# Altium project PLWD_Schematics.PrjPcb (part 2 of 3)

## Sheet GPS_CAM-M8Q.SchDoc
size A4; SheetNumber: 4; SheetTotal: 10
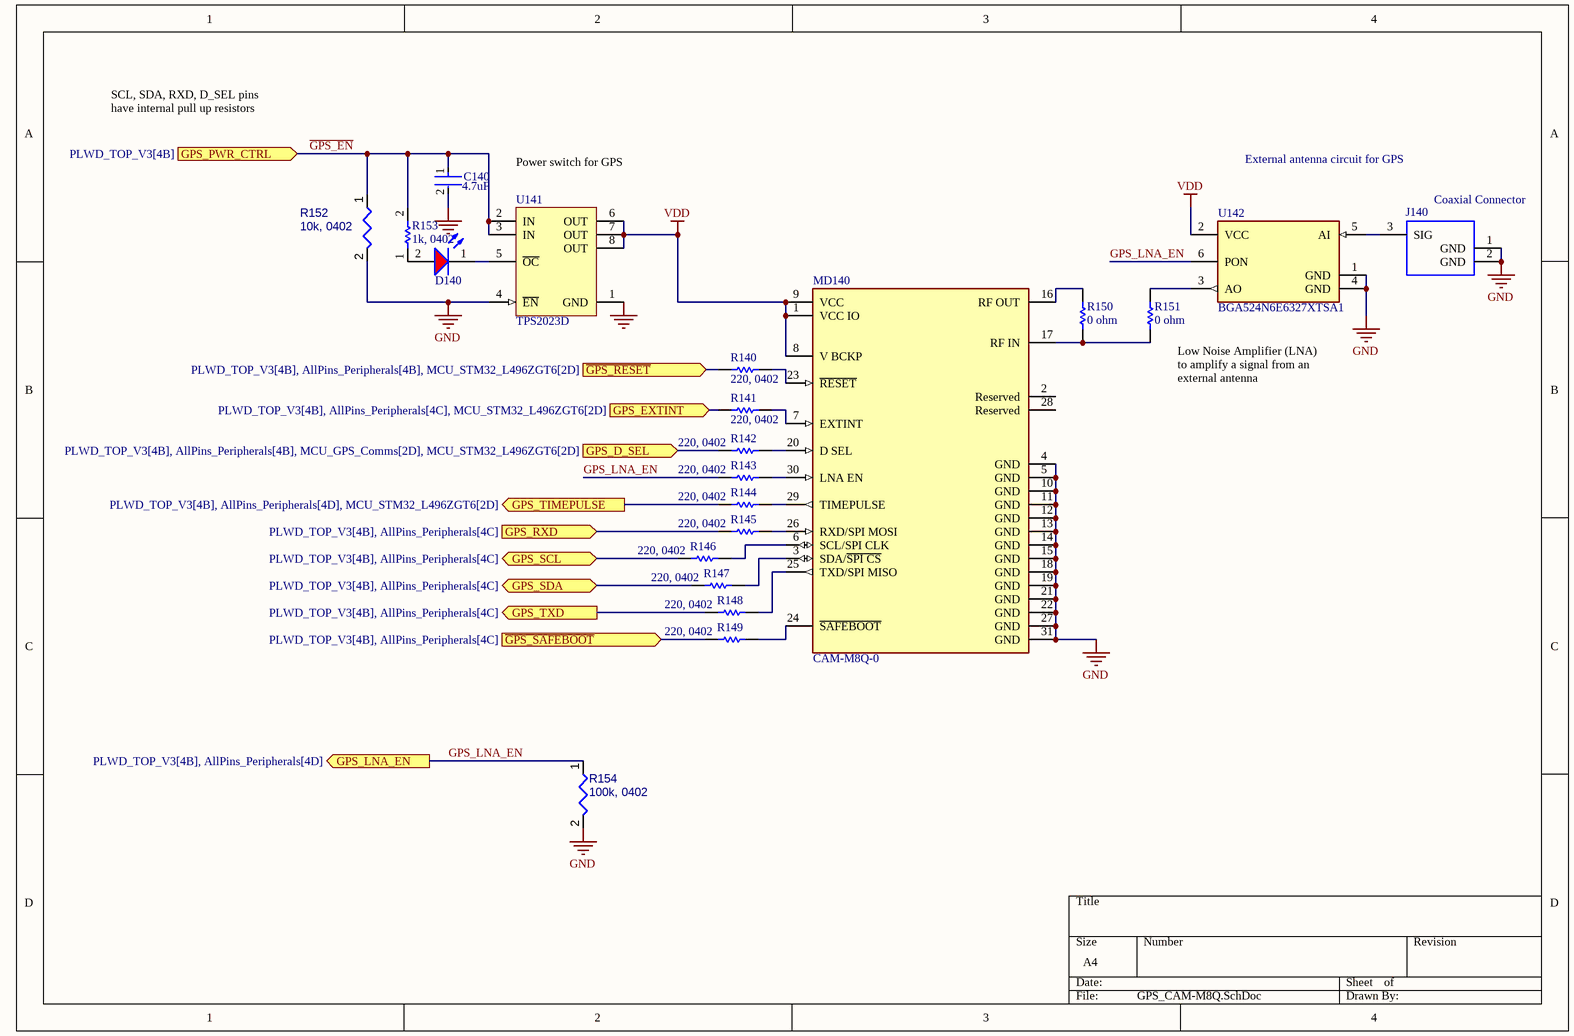
[diagram p3: GPS_CAM-M8Q.SchDoc]

### Parts
C140  Capacitance: 4.7uF  [FP-CL282-IPC_C]  (hidden comment: CL05A475MP5NRNC)
D140  150120SS75000  [WL-SMCW_1206_150120xx75000]  (value not drawn)
J140  Coaxial Connector  [HRS-U.FL-R-SMT_V]
MD140  CAM-M8Q-0  [FP-CAM-M8Q-0-MFG]
R140  220, 0402  [RESC1005X40X25LL10T10]
R141  220, 0402  [RESC1005X40X25LL10T10]
R142  220, 0402  [RESC1005X40X25LL10T10]
R143  220, 0402  [RESC1005X40X25LL10T10]
R144  220, 0402  [RESC1005X40X25LL10T10]
R145  220, 0402  [RESC1005X40X25LL10T10]
R146  220, 0402  [RESC1005X40X25LL10T10]
R147  220, 0402  [RESC1005X40X25LL10T10]
R148  220, 0402  [RESC1005X40X25LL10T10]
R149  220, 0402  [RESC1005X40X25LL10T10]
R150  0 ohm  [RESC1005X40X25LL05T10]
R151  0 ohm  [RESC1005X40X25LL05T10]
R152  10k, 0402  [RESC1005X40X25ML05T05]
R153  1k, 0402  [RESC1005X40X25ML05T05]
R154  100k, 0402  [RESC1005X40X25ML05T05]
U141  TPS2023D  [D0008A_M]
U142  BGA524N6E6327XTSA1  [FP-PG-TSNP-6-MFG]

### Ports
GPS_D_SEL (in, see PLWD_TOP_V3[4B], AllPins_Peripherals[4B], MCU_GPS_Comms[2D], MCU_STM32_L496ZGT6[2D]), GPS_EXTINT (in, see PLWD_TOP_V3[4B], AllPins_Peripherals[4C], MCU_STM32_L496ZGT6[2D]), GPS_LNA_EN (out, see PLWD_TOP_V3[4B], AllPins_Peripherals[4D]), GPS_PWR_CTRL (in, see PLWD_TOP_V3[4B]), GPS_RXD (in, see PLWD_TOP_V3[4B], AllPins_Peripherals[4C]), GPS_SCL (bidir, see PLWD_TOP_V3[4B], AllPins_Peripherals[4C]), GPS_SDA (bidir, see PLWD_TOP_V3[4B], AllPins_Peripherals[4C]), GPS_TIMEPULSE (out, see PLWD_TOP_V3[4B], AllPins_Peripherals[4D], MCU_STM32_L496ZGT6[2D]), GPS_TXD (out, see PLWD_TOP_V3[4B], AllPins_Peripherals[4C]), ~{GPS_RESET} (in, see PLWD_TOP_V3[4B], AllPins_Peripherals[4B], MCU_STM32_L496ZGT6[2D]), ~{GPS_SAFEBOOT} (in, see PLWD_TOP_V3[4B], AllPins_Peripherals[4C])

### Nets
GND: C140.2 J140.1(GND) J140.2(GND) MD140.4(GND) MD140.5(GND) MD140.10(GND) MD140.11(GND) MD140.12(GND) MD140.13(GND) MD140.14(GND) MD140.15(GND) MD140.18(GND) MD140.19(GND) MD140.21(GND) MD140.22(GND) MD140.27(GND) MD140.31(GND) R152.2 R154.2 U141.1(GND) U141.4(~{EN}) U142.1(GND) U142.4(GND)
VDD: MD140.1(VCC_IO) MD140.8(V_BCKP) MD140.9(VCC) U141.6(OUT) U141.7(OUT) U141.8(OUT) U142.2(VCC)  [project net VDD_MCU]
~{GPS_EN}: C140.1 R152.1 R153.2 U141.2(IN) U141.3(IN) ; port GPS_PWR_CTRL
~{GPS_RESET}: R140.2 ; port ~{GPS_RESET}
~{GPS_SBT}: R149.2 ; port ~{GPS_SAFEBOOT}
GPS_D_SEL: R142.2 ; port GPS_D_SEL
GPS_EXTINT: R141.2 ; port GPS_EXTINT
GPS_LNA_EN: R143.2 R154.1 U142.6(PON) ; port GPS_LNA_EN
GPS_RXD/SPI_MOSI: R145.2 ; port GPS_RXD
GPS_SCL/SPI_CLK: R146.2 ; port GPS_SCL
GPS_SDA/SPI_SSEL: R147.2 ; port GPS_SDA
GPS_TIMEPULSE: R144.2 ; port GPS_TIMEPULSE
GPS_TXD/SPI_MISO: R148.2 ; port GPS_TXD
NetD140_1: D140.1(K) U141.5(~{OC})
NetD140_2: D140.2(A) R153.1
NetJ140_3: J140.3(SIG) U142.5(AI)
NetMD140_3: MD140.3(SDA/~{SPI_CS}) R147.1
NetMD140_6: MD140.6(SCL/SPI_CLK) R146.1
NetMD140_7: MD140.7(EXTINT) R141.1
NetMD140_16: MD140.16(RF_OUT) R150.2
NetMD140_17: MD140.17(RF_IN) R150.1 R151.1
NetMD140_20: MD140.20(D_SEL) R142.1
NetMD140_23: MD140.23(~{RESET}) R140.1
NetMD140_24: MD140.24(~{SAFEBOOT}) R149.1
NetMD140_25: MD140.25(TXD/SPI_MISO) R148.1
NetMD140_26: MD140.26(RXD/SPI_MOSI) R145.1
NetMD140_29: MD140.29(TIMEPULSE) R144.1
NetMD140_30: MD140.30(LNA_EN) R143.1
NetR151_2: R151.2 U142.3(AO)

Not connected (* = marked no-connect by the designer): MD140 2(Reserved) 28(Reserved)

### Notes on the sheet
- SCL, SDA, RXD, D_SEL pins have internal pull up resistors
- (near U141) Power switch for GPS
- External antenna circuit for GPS
- (near R151) Low Noise Amplifier (LNA) to amplify a signal from an external antenna

### Library data of the parts
C140 = CMP-13271-000548-1: as C112 on sheet MCU_STM32_L496ZGT6; Max Operating Temperature: 85°C; Lead Free: Lead Free; Tolerance: 20%; Voltage Rating: 10V; Dielectric: X5R; Width: 0.02inch; Length: 0.039inch; Case/Package: 0402; Min Operating Temperature: -55°C; Packaging: Tape and Reel; Thickness: 0.022inch; Case Code (Imperial): 0402; Package Quantity: 10000; Case Code (Metric): 1005; Mount: Surface Mount
D140 = CMP-1426-00017-2: NexarPartId: 29717789; Luminous Intensity: 60mcd; Viewing Angle: 140°; Test Current: 20mA; Lens Style: Clear, Rectangular; Wavelength: 630nm; Max Reverse Voltage (DC): 5V; Color: Red; Forward Current: 100mA; Peak Wavelength: 645nm; Forward Voltage: 1.9V; Case Code (Imperial): 1206; Mount: Surface Mount; Height: 680µm; RoHS: Compliant; REACH SVHC: Unknown; Case Code (Metric): 3216; Width: 1.6mm; Dominant Wavelength: 630nm; Packaging: Tape and Reel; Min Operating Temperature: -40°C; Max Operating Temperature: 85°C; Case/Package: 1206; Length: 3.2mm
J140 = CMP-002-00035-2: Ultra Small Surface Mount Coaxial Connector, 50 Ohm, -40 to 90 degC, 3-Pin SMD, RoHS, Tape and Reel; Manufacturer: Hirose Electric; Impedance: 50Ohm; Connector Type: RF&Coax; Max Operating Temperature: 90°C; Contact Material: Brass; Packaging: TapeandReel; Mounting Technology: SM; Package Quantity: 2500; Min Operating Temperature: -40°C; Contact Plating: Gold; RoHS Compliant: True; Datasheet Version: Aug-16; Package Description: 3-Pin Surface Mount Device, Body 2.6 x 2.6 mm; Datasheet URL: https://www.hirose.com/product/en/download_file/key_name/U.FL/category/Catalog/doc_file_id/31697/?file_category_id=4&item_id=15&is_series=1; Package Reference: U.FL-R-SMT; Fastening Type: Snap; Resistance: 50Ohm; Manufacturer URL: https://www.hirose.com; Case/Package: U.FL-R-SMT
MD140 = CMP-207130-000001-1: RF RCVR GNSS/GPS 1.575GHZ MODULE; Manufacturer: u-blox; Data Rate: 400kbits/s; Max Frequency: 1602MHz; Min Supply Voltage: 1.4V; Nominal Supply Current: 10.4-30mA; Sensitivity: -138dBm; Interface: I2C,SPI,UART; Max Supply Voltage: 3.6V; Automotive Grade: NA; Octopart: https://octopart.com/cam-m8q-0-u-blox-54356730; Automotive: No; Package: CAM-M8Q-0; Device Class L1: Integrated Circuits (ICs); RoHS: TRUE; Footprint Url: https://www.u-blox.com/sites/default/files/CAM-M8-FW3_HardwareIntegrationManual_%28UBX-15030063%29.pdf; Height: 2.3mm; Device Class L3: RF Receivers; Temperature Range Low: -40°C; Manufacturer Part Number: CAM-M8Q-0; Device Class L2: RF Semiconductors and Devices; Temperature Range High: +85°C; ComponentLink2Description: Datasheet; Digikey Description: RF RCVR GNSS/GPS 1.575GHZ MODULE; ComponentLink2URL: https://www.u-blox.com/sites/default/files/CAM-M8-FW3_DataSheet_%28UBX-15031574%29.pdf; Category: UNK; Temperature: -40°C to +85°C; Lead Free: Yes
R140-R149 = CMP-2002-03891-1: Part Number: RK73H1ETTP2200F; Manufacturer: KOA Speer
R150 R151 = CMP-2002-06455-1: Manufacturer: Panasonic; Part Number: ERJ-S020R00X
R152 = CMP-009-00015-5: as R101 on sheet MCU_STM32_L496ZGT6; Case/Package: 0402; Value: 10k; RoHS Compliant: True; Min Operating Temperature: -55°C; Mounting Technology: SM; Tolerance: 1%; Max Operating Temperature: 155°C; Pins: 2
R153 = CMP-009-00009-5: Chip Resistor, 1 KOhm, +/- 1%, 0.1 W, -55 to 155 degC, 0402 (1005 Metric); Power: 100mW; Voltage Rating: 50V; Min Operating Temperature: -55°C; Max Operating Temperature: 155°C; RoHS Compliant: True; Mounting Technology: SM; Pins: 2; Tolerance: 1%; Case/Package: 0402; Value: 1k
R154 = CMP-009-00022-5: Chip Resistor, 100 KOhm, +/- 1%, 0.1 W, -55 to 155 degC, 0402 (1005 Metric); Power: 100mW; Voltage Rating: 50V; Mounting Technology: SM; Pins: 2; Value: 100k; Min Operating Temperature: -55°C; Tolerance: 1%; RoHS Compliant: True; Case/Package: 0402; Max Operating Temperature: 155°C
U141 = CMP-0337-00189-2: 1.65 A, 2.7 to 5.5 V Single Power Distribution Switch IC Hi-Side MOSFET, Fault Report, 33 mOhms rDS(On), -40 to 85 degC, 8-pin SOIC (D), Green (RoHS & no Sb/Br); Manufacturer: Texas Instruments; Continuous Current(Max)(A): 1.5; Enable: Active Low; Number of Switches: 1; Current Limit(A): 2.2; Vin(Max)(V): 5.5; Vin(Min)(V): 2.7; rDS(on) per FET(Typ)(mOhms): 33; Rating: Catalog; Eco-Plan: Green (RoHS & no Sb/Br); PartNumber: TPS2023D; PackageVersion: revM, Jun-2011; ComponentLink1URL: http://www.ti.com/general/docs/lit/getliterature.tsp?genericPartNumber=TPS2023&fileType=pdf; Code_JEDEC: MS-012AA; DatasheetVersion: SLVS175C; ComponentLink1Description: Datasheet; Mounting Technology: Surface Mount; PackageDescription: 8-Pin Plastic Small Outline Integrated Circuit, 4.9 x 3.9 mm, Pitch 1.27 mm Pitch; PackageReference: D0008A
U142 = CMP-32860-000011-1: IC AMP GPS 1.55-1.615GHZ TSNP6-2; P1dB: -16dBm; Gain: 19.6dB; Operating Supply Current: 2.5mA; Noise Figure: 0.55dB; Number of Channels: 1; Mount: Surface Mount; Frequency: 1.615GHz; Number of Pins: 6; Lead Free: Lead Free; Packaging: Cut Tape; Package Quantity: 15000; Series: -; Halogen Free: Halogen Free; RoHS Compliant: Yes; Test Frequency: 1.615GHz

## Sheet BLE_ESP32-WROOM-32.SchDoc
size A4; SheetNumber: 5; SheetTotal: 9
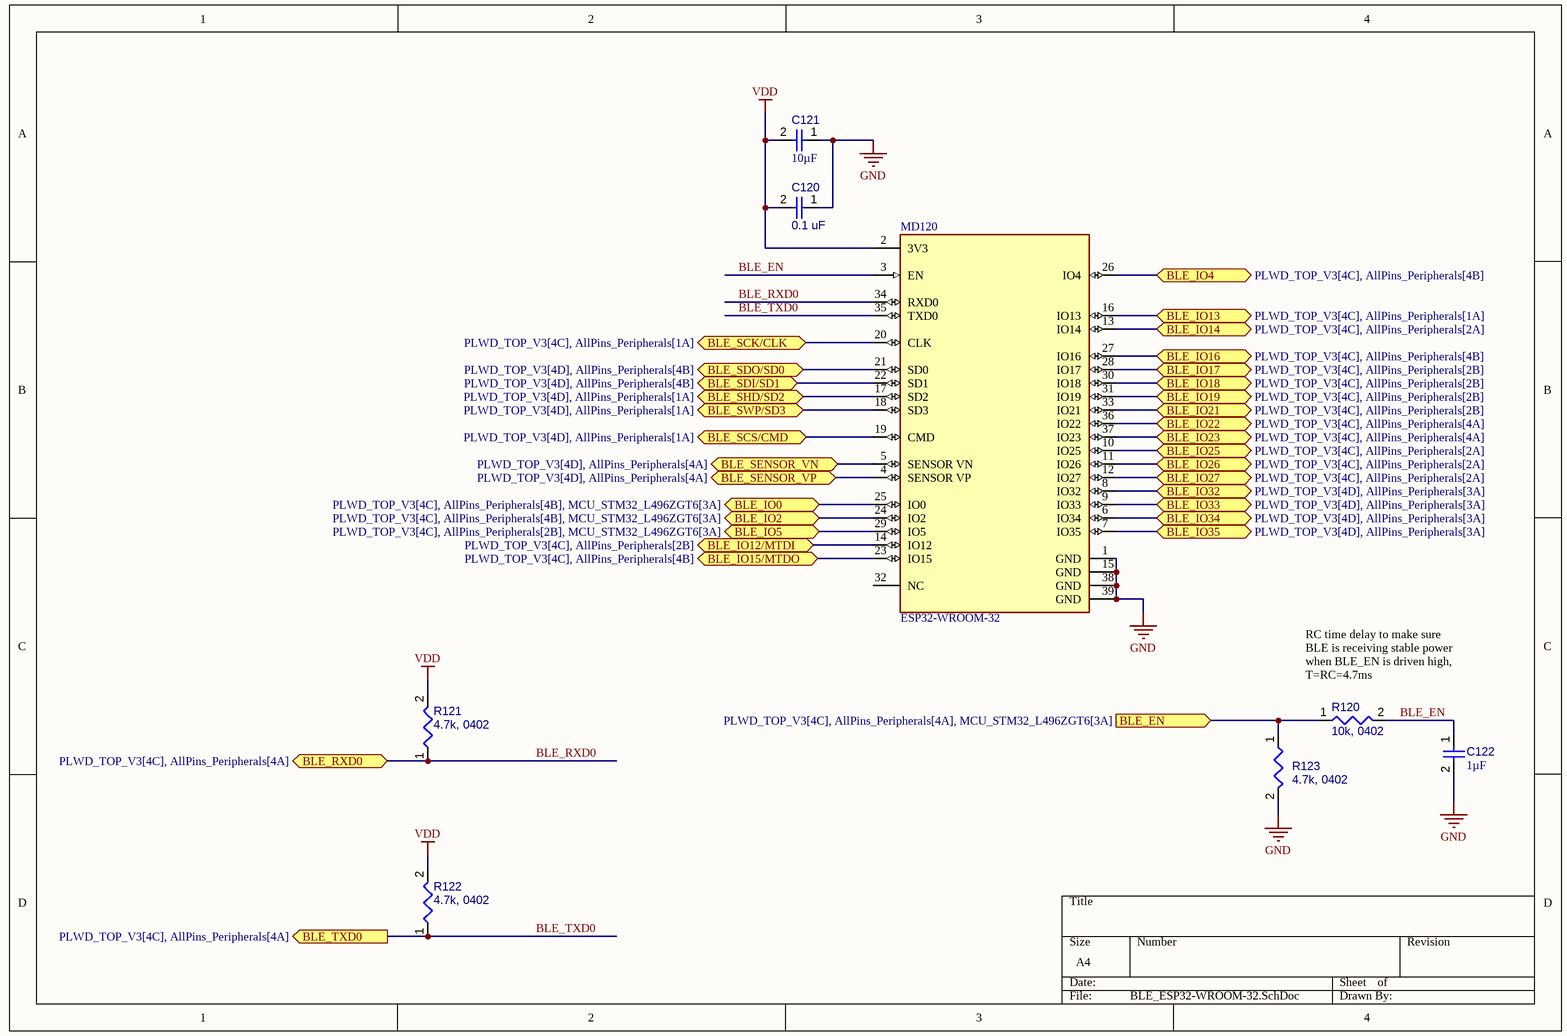
[diagram p4: BLE_ESP32-WROOM-32.SchDoc]

### Parts
C120  0.1 uF  [CAPC1005X56X25LL10T15]
C121  value 10µF  [CAPC0603(1608)100_L]  (hidden comment: Capacitor 10µF +/-20% 10V 0603)
C122  value 1µF  [CAPC0402(1005)60_L]  (hidden comment: Capacitor 1µF +/-20% 10V 0402)
MD120  ESP32-WROOM-32  [FP-ESP32-WROOM-32-MFG]
R120  10k, 0402  [RESC1005X40X25ML05T05]
R121  4.7k, 0402  [RESC0402(1005)_L]
R122  4.7k, 0402  [RESC0402(1005)_L]
R123  4.7k, 0402  [RESC0402(1005)_L]

### Ports
BLE_EN (in, see PLWD_TOP_V3[4C], AllPins_Peripherals[4A], MCU_STM32_L496ZGT6[3A]), BLE_IO0 (bidir, see PLWD_TOP_V3[4C], AllPins_Peripherals[4B], MCU_STM32_L496ZGT6[3A]), BLE_IO2 (bidir, see PLWD_TOP_V3[4C], AllPins_Peripherals[4B], MCU_STM32_L496ZGT6[3A]), BLE_IO4 (bidir, see PLWD_TOP_V3[4C], AllPins_Peripherals[4B]), BLE_IO5 (bidir, see PLWD_TOP_V3[4C], AllPins_Peripherals[2B], MCU_STM32_L496ZGT6[3A]), BLE_IO12/MTDI (bidir, see PLWD_TOP_V3[4C], AllPins_Peripherals[2B]), BLE_IO13 (bidir, see PLWD_TOP_V3[4C], AllPins_Peripherals[1A]), BLE_IO14 (bidir, see PLWD_TOP_V3[4C], AllPins_Peripherals[2A]), BLE_IO15/MTDO (bidir, see PLWD_TOP_V3[4C], AllPins_Peripherals[4B]), BLE_IO16 (bidir, see PLWD_TOP_V3[4C], AllPins_Peripherals[4B]), BLE_IO17 (bidir, see PLWD_TOP_V3[4C], AllPins_Peripherals[2B]), BLE_IO18 (bidir, see PLWD_TOP_V3[4C], AllPins_Peripherals[2B]), BLE_IO19 (bidir, see PLWD_TOP_V3[4C], AllPins_Peripherals[2B]), BLE_IO21 (bidir, see PLWD_TOP_V3[4C], AllPins_Peripherals[2B]), BLE_IO22 (bidir, see PLWD_TOP_V3[4C], AllPins_Peripherals[4A]), BLE_IO23 (bidir, see PLWD_TOP_V3[4C], AllPins_Peripherals[4A]), BLE_IO25 (bidir, see PLWD_TOP_V3[4C], AllPins_Peripherals[2A]), BLE_IO26 (bidir, see PLWD_TOP_V3[4C], AllPins_Peripherals[2A]), BLE_IO27 (bidir, see PLWD_TOP_V3[4C], AllPins_Peripherals[2A]), BLE_IO32 (bidir, see PLWD_TOP_V3[4D], AllPins_Peripherals[3A]), BLE_IO33 (bidir, see PLWD_TOP_V3[4D], AllPins_Peripherals[3A]), BLE_IO34 (bidir, see PLWD_TOP_V3[4D], AllPins_Peripherals[3A]), BLE_IO35 (bidir, see PLWD_TOP_V3[4D], AllPins_Peripherals[3A]), BLE_RXD0 (bidir, see PLWD_TOP_V3[4C], AllPins_Peripherals[4A]), BLE_SCK/CLK (bidir, see PLWD_TOP_V3[4C], AllPins_Peripherals[1A]), BLE_SCS/CMD (bidir, see PLWD_TOP_V3[4D], AllPins_Peripherals[1A]), BLE_SDI/SD1 (bidir, see PLWD_TOP_V3[4D], AllPins_Peripherals[4B]), BLE_SDO/SD0 (bidir, see PLWD_TOP_V3[4D], AllPins_Peripherals[4B]), BLE_SENSOR_VN (bidir, see PLWD_TOP_V3[4D], AllPins_Peripherals[4A]), BLE_SENSOR_VP (bidir, see PLWD_TOP_V3[4D], AllPins_Peripherals[4A]), BLE_SHD/SD2 (bidir, see PLWD_TOP_V3[4D], AllPins_Peripherals[1A]), BLE_SWP/SD3 (bidir, see PLWD_TOP_V3[4D], AllPins_Peripherals[1A]), BLE_TXD0 (out, see PLWD_TOP_V3[4C], AllPins_Peripherals[4A])

### Nets
GND: C120.1 C121.1 C122.2 MD120.1(GND) MD120.15(GND) MD120.38(GND) MD120.39(GND) R123.2
VDD: C120.2 C121.2 MD120.2(3V3) R121.2 R122.2  [project net VDD_MCU]
BLE_EN: R120.1 R123.1 ; port BLE_EN
BLE_EN: C122.1 MD120.3(EN) R120.2  [a separate net that carries the same name]
BLE_IO0: MD120.25(IO0) ; port BLE_IO0
BLE_IO2: MD120.24(IO2) ; port BLE_IO2
BLE_IO4: MD120.26(IO4) ; port BLE_IO4
BLE_IO5: MD120.29(IO5) ; port BLE_IO5
BLE_IO12/MTDI: MD120.14(IO12) ; port BLE_IO12/MTDI
BLE_IO13: MD120.16(IO13) ; port BLE_IO13
BLE_IO14: MD120.13(IO14) ; port BLE_IO14
BLE_IO15_MTDO: MD120.23(IO15) ; port BLE_IO15/MTDO
BLE_IO16: MD120.27(IO16) ; port BLE_IO16
BLE_IO17: MD120.28(IO17) ; port BLE_IO17
BLE_IO18: MD120.30(IO18) ; port BLE_IO18
BLE_IO19: MD120.31(IO19) ; port BLE_IO19
BLE_IO21: MD120.33(IO21) ; port BLE_IO21
BLE_IO22: MD120.36(IO22) ; port BLE_IO22
BLE_IO23: MD120.37(IO23) ; port BLE_IO23
BLE_IO25: MD120.10(IO25) ; port BLE_IO25
BLE_IO26: MD120.11(IO26) ; port BLE_IO26
BLE_IO27: MD120.12(IO27) ; port BLE_IO27
BLE_IO32: MD120.8(IO32) ; port BLE_IO32
BLE_IO33: MD120.9(IO33) ; port BLE_IO33
BLE_IO34: MD120.6(IO34) ; port BLE_IO34
BLE_IO35: MD120.7(IO35) ; port BLE_IO35
BLE_RXD0: MD120.34(RXD0) R121.1 ; port BLE_RXD0
BLE_SCK/CLK: MD120.20(CLK) ; port BLE_SCK/CLK
BLE_SCS/CMD: MD120.19(CMD) ; port BLE_SCS/CMD
BLE_SDI/SD1: MD120.22(SD1) ; port BLE_SDI/SD1
BLE_SDO/SD0: MD120.21(SD0) ; port BLE_SDO/SD0
BLE_SENSOR_VN: MD120.5(SENSOR_VN) ; port BLE_SENSOR_VN
BLE_SENSOR_VP: MD120.4(SENSOR_VP) ; port BLE_SENSOR_VP
BLE_SHD/SD2: MD120.17(SD2) ; port BLE_SHD/SD2
BLE_SWP/SD3: MD120.18(SD3) ; port BLE_SWP/SD3
BLE_TXD0: MD120.35(TXD0) R122.1 ; port BLE_TXD0

Not connected (* = marked no-connect by the designer): MD120 32(NC)

### Notes on the sheet
- (near R120) RC time delay to make sure BLE is receiving stable power when BLE_EN is driven high, T=RC=4.7ms

### Library data of the parts
C120 = CMP-001-00001-6: as C100 on sheet MCU_STM32_L496ZGT6; Min Operating Temperature: -55°C; Pins: 2; Case/Package: 0402; Max Operating Temperature: 125°C; Mounting Technology: SM; RoHS Compliant: True; Tolerance: 5%
C121 = CMP-001-00075-4: Chip Capacitor, 10µF +/-20%, 10V, 0603, Thickness 1 mm; Tolerance: 10%; Voltage Rating: 10V; Max Operating Temperature: 85°C; Pins: 2; Case/Package: 0603; Mounting Technology: SMT; Min Operating Temperature: -55°C
C122 = CMP-001-00063-3: as C114 on sheet MCU_STM32_L496ZGT6; Mounting Technology: SMT; Max Operating Temperature: 85°C; Voltage Rating: 10V; Pins: 2; Case/Package: 0402; Min Operating Temperature: -55°C
MD120 = CMP-194065-000008-1: RX TXRX MOD WIFI SURFACE MOUNT; Frequency: 2.5GHz; Sensitivity: -98dBm; Operating Supply Voltage: 3.6V; Data Rate: 150Mbps; Weight: 0.088185oz; Package Quantity: 550; Min Operating Temperature: -40°C; Mount: Surface Mount; Max Operating Temperature: 85°C; Packaging: Cut Tape; Case/Package: SMD/SMT
R120 = CMP-009-00015-5: as R101 on sheet MCU_STM32_L496ZGT6; Case/Package: 0402; Value: 10k; RoHS Compliant: True; Min Operating Temperature: -55°C; Mounting Technology: SM; Tolerance: 1%; Max Operating Temperature: 155°C; Pins: 2
R121-R123 = CMP-009-00158-3: as R100 on sheet MCU_STM32_L496ZGT6; Max Operating Temperature: 155°C; Pins: 2; Value: 4.7k; Min Operating Temperature: -55°C; Case/Package: 0402

## Sheet PowerSupply.SchDoc
size A4; SheetNumber: 6; SheetTotal: 10
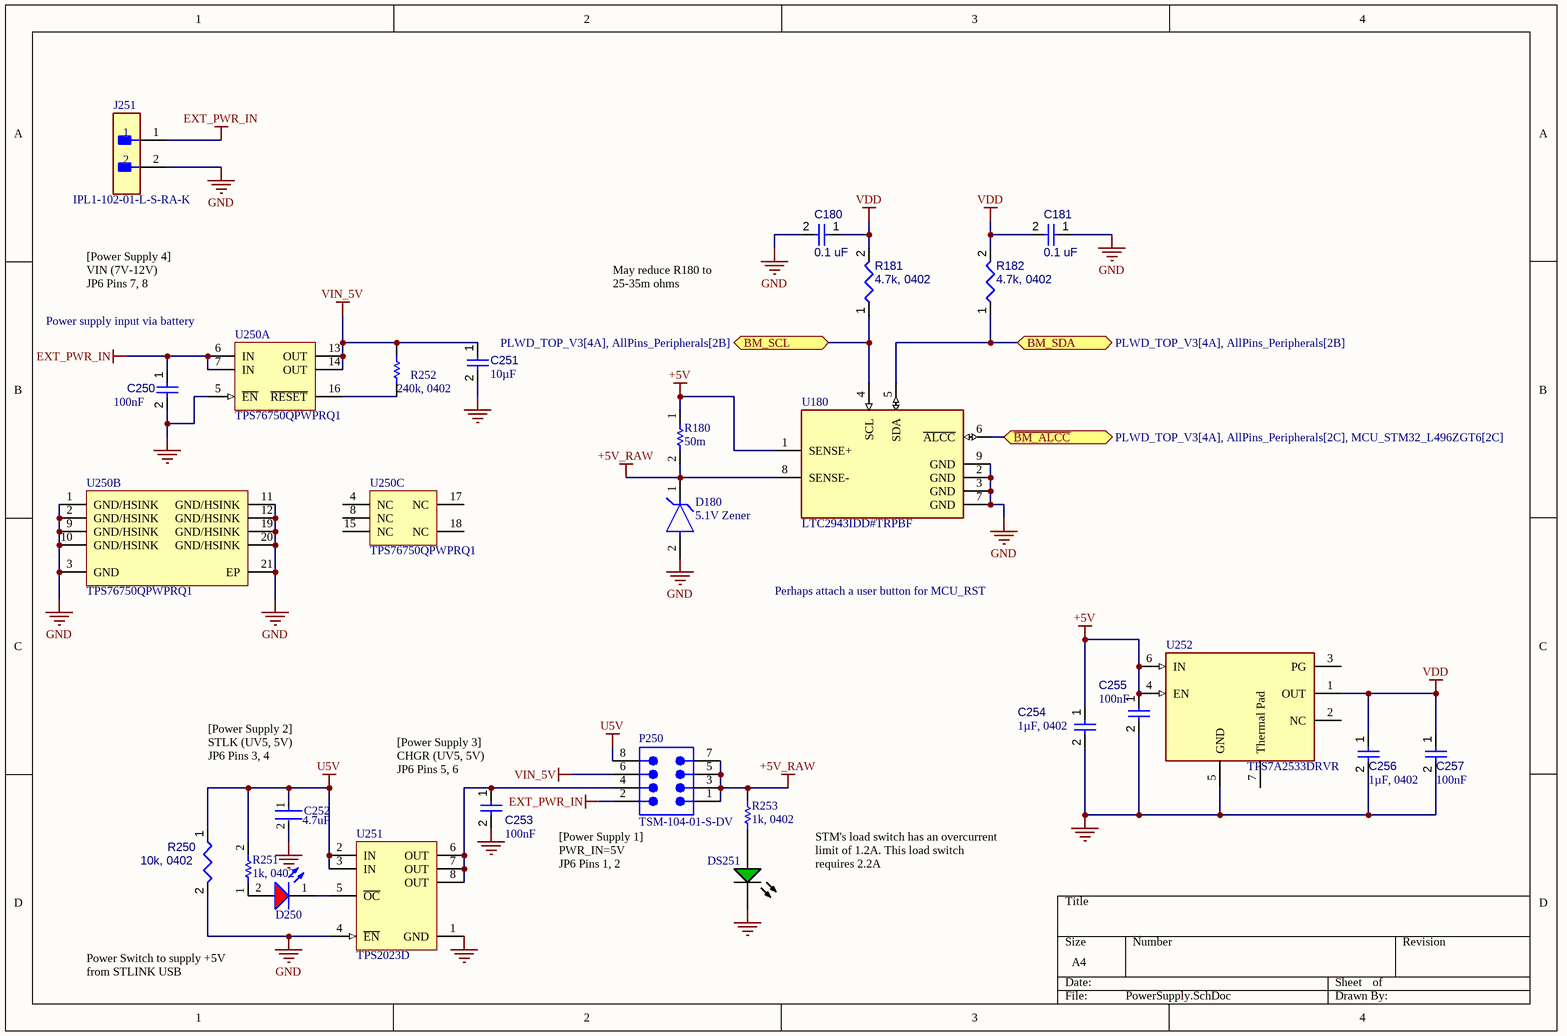
[diagram p5: PowerSupply.SchDoc]

### Parts
C180  0.1 uF  [CAPC1005X56X25LL10T15]
C181  0.1 uF  [CAPC1005X56X25LL10T15]
C250  value 100nF  [CAPC1005X56X25LL10T15]  (hidden comment: Capacitor 0.1 uF +/- 5% 16 V 0402)
C251  value 10µF  [CAPC0603(1608)100_L]  (hidden comment: Capacitor 10µF +/-20% 10V 0603)
C252  Capacitance: 4.7uF  [FP-CL282-IPC_C]  (hidden comment: CL05A475MP5NRNC)
C253  value 100nF  [CAPC1005X56X25LL10T15]  (hidden comment: Capacitor 0.1 uF +/- 5% 16 V 0402)
C254  value 1µF, 0402  [CAPC0402(1005)60_L]  (hidden comment: Capacitor 1µF +/-20% 10V 0402)
C255  value 100nF  [CAPC1005X56X25LL10T15]  (hidden comment: Capacitor 0.1 uF +/- 5% 16 V 0402)
C256  value 1µF, 0402  [CAPC0402(1005)60_L]  (hidden comment: Capacitor 1µF +/-20% 10V 0402)
C257  value 100nF  [CAPC1005X56X25LL10T15]  (hidden comment: Capacitor 0.1 uF +/- 5% 16 V 0402)
D180  5.1V Zener  [FP-SOD123-MFG]
D250  150120SS75000  [WL-SMCW_1206_150120xx75000]  (value not drawn)
DS251  LTST-C190GKT  [LTST-C190GKT_V]  (value not drawn)
J251  IPL1-102-01-L-S-RA-K  [FP-IPL1-102-01-L-S-RA-K-0]
P250  TSM-104-01-S-DV  [SMTC-TSM-104-01-X-DV]
R180  50m  [RESC1608X55X30NL15T15]
R181  4.7k, 0402  [RESC0402(1005)_L]
R182  4.7k, 0402  [RESC0402(1005)_L]
R250  10k, 0402  [RESC1005X40X25ML05T05]
R251  1k, 0402  [RESC1005X40X25ML05T05]
R252  240k, 0402  [RESC1005X40X25NL05T05]
R253  1k, 0402  [RESC1005X40X25ML05T05]
U180  LTC2943IDD#TRPBF  [FP-DD-8-05-08-1698-IPC_B]
U250  TPS76750QPWPRQ1  [PWP0020L_N]  (parts A,B,C of 3)
U251  TPS2023D  [D0008A_M]
U252  TPS7A2533DRVR  [FP-DRV0006A-IPC_C]

### Ports
BM_SCL (bidir, see PLWD_TOP_V3[4A], AllPins_Peripherals[2B]), BM_SDA (bidir, see PLWD_TOP_V3[4A], AllPins_Peripherals[2B]), ~{BM_ALCC} (bidir, see PLWD_TOP_V3[4A], AllPins_Peripherals[2C], MCU_STM32_L496ZGT6[2C])

### Nets
+5V: C254.1 C255.1 R180.1 U180.1(SENSE+) U252.4(EN) U252.6(IN)
+5V_RAW: D180.1(C) P250.1 P250.3 P250.5 P250.7 R180.2 R253.2 U180.8(SENSE-)
EXT_PWR_IN: C250.1 J251.1 P250.2 U250.6(IN) U250.7(IN)
GND: C180.2 C181.1 C250.2 C251.2 C252.2 C253.2 C254.2 C255.2 C256.2 C257.2 D180.2(A) DS251.2(K) J251.2 R250.2 U180.2(GND) U180.3(GND) U180.7(GND) U180.9(GND) U250.1(GND/HSINK) U250.2(GND/HSINK) U250.3(GND) U250.5(~{EN}) U250.9(GND/HSINK) U250.10(GND/HSINK) U250.11(GND/HSINK) U250.12(GND/HSINK) U250.19(GND/HSINK) U250.20(GND/HSINK) U250.21(EP) U251.1(GND) U251.4(~{EN}) U252.5(GND)
U5V: C252.1 P250.8 R250.1 R251.2 U251.2(IN) U251.3(IN)
VDD: C180.1 C181.2 C256.1 C257.1 R181.2 R182.2 U252.1(OUT)  [project net VDD_MCU]
VIN_5V: C251.1 P250.6 R252.2 U250.13(OUT) U250.14(OUT)
~{BM_ALCC}: U180.6(~{ALCC}) ; port ~{BM_ALCC}
BM_SCL: R181.1 U180.4(SCL) ; port BM_SCL
BM_SDA: R182.1 U180.5(SDA) ; port BM_SDA
NetC253_1: C253.1 P250.4 U251.6(OUT) U251.7(OUT) U251.8(OUT)
NetD250_1: D250.1(K) U251.5(~{OC})
NetD250_2: D250.2(A) R251.1
NetDS251_1: DS251.1(A) R253.1
NetR252_1: R252.1 U250.16(~{RESET})

Not connected (* = marked no-connect by the designer): U250 4(NC) 8(NC) 15(NC) 17(NC) 18(NC); U252 2(NC) 3(PG) 7(Thermal_Pad)

### Notes on the sheet
- [Power Supply 4]
  VIN (7V-12V)
  JP6 Pins 7, 8
- May reduce R180 to 25-35m ohms
- (near U250) Power supply input via battery
- Perhaps attach a user button for MCU_RST
- (near C252) [Power Supply 2]
  STLK (UV5, 5V)
  JP6 Pins 3, 4
- (near C253) [Power Supply 3]
  CHGR (UV5, 5V)
  JP6 Pins 5, 6
- (near P250) [Power Supply 1]
  PWR_IN=5V
  JP6 Pins 1, 2
- STM's load switch has an overcurrent limit of 1.2A. This load switch requires 2.2A
- Power Switch to supply +5V from STLINK USB

### Library data of the parts
C180 C181 = CMP-001-00001-6: Chip Capacitor, 0.1 uF, +/- 5%, 16 V, 0402 (1005 Metric); Value: 100nF; Capacitor Type: Ceramic; Voltage Rating: 16V; Min Operating Temperature: -55°C; Pins: 2; Case/Package: 0402; Max Operating Temperature: 125°C; Mounting Technology: SM; RoHS Compliant: True; Tolerance: 5%
C250 C253 C255 C257 = CMP-001-00001-6: Chip Capacitor, 0.1 uF, +/- 5%, 16 V, 0402 (1005 Metric); Capacitor Type: Ceramic; Voltage Rating: 16V; Max Operating Temperature: 125°C; Min Operating Temperature: -55°C; Case/Package: 0402; Mounting Technology: SM; Pins: 2; Tolerance: 5%; RoHS Compliant: True
C251 = CMP-001-00075-4: Chip Capacitor, 10µF +/-20%, 10V, 0603, Thickness 1 mm; Tolerance: 10%; Voltage Rating: 10V; Max Operating Temperature: 85°C; Pins: 2; Case/Package: 0603; Mounting Technology: SMT; Min Operating Temperature: -55°C
C252 = CMP-13271-000548-1: Cap Ceramic 4.7uF 10V X5R ±20% SMD 0402 +85°C Paper T/R; Max Operating Temperature: 85°C; Lead Free: Lead Free; Tolerance: 20%; Voltage Rating: 10V; Dielectric: X5R; Width: 0.02inch; Length: 0.039inch; Case/Package: 0402; Min Operating Temperature: -55°C; Packaging: Tape and Reel; Thickness: 0.022inch; Case Code (Imperial): 0402; Package Quantity: 10000; Case Code (Metric): 1005; Mount: Surface Mount
C254 C256 = CMP-001-00063-3: Chip Capacitor, 1µF +/-20%, 10V, 0402, Thickness 0.6 mm; Tolerance: 10%; Mounting Technology: SMT; Max Operating Temperature: 85°C; Voltage Rating: 10V; Pins: 2; Case/Package: 0402; Min Operating Temperature: -55°C
D180 = CMP-2000-05976-2: DIODE ZENER 5.1V 500MW SOD123; Manufacturer Part Number: BZT52C5V1-7-F; Manufacturer: Diodes Incorporated; Standoff Height: 0mm; Max Reverse Leakage Current: 2uA; Forward Current: 10mA; Power Dissipation: 370mW; Max Zener Voltage: 5.4V; Zener Impedance: 60Ω; Automotive Grade: NA; Max Junction Temp: +150°C; Device Class L3: Zener Diodes; ComponentLink2Description: Datasheet; Mouser Description: Zener Diodes 5.1V 500mW; Octopart: https://octopart.com/bzt52c5v1-7-f-diodes+inc.-326718; Package: SOD123; RoHS: TRUE; Nom Zener Voltage: 5.1V; Device Class L1: Discrete Semiconductors; Lead Free: Yes; Footprint Url: https://www.diodes.com/assets/Package-Files/SOD123.pdf; ComponentLink2URL: https://www.diodes.com/assets/Datasheets/ds18004.pdf; Digikey Description: DIODE ZENER 5.1V 500MW SOD123; Height: 1.45mm; Temperature Range Low: -65°C; Device Class L2: Diodes; Temperature: -65°C to +150°C; Automotive: No; Temperature Range High: +150°C; Category: Diode
D250 = CMP-1426-00017-2: NexarPartId: 29717789; Luminous Intensity: 60mcd; Viewing Angle: 140°; Test Current: 20mA; Lens Style: Clear, Rectangular; Wavelength: 630nm; Max Reverse Voltage (DC): 5V; Color: Red; Forward Current: 100mA; Peak Wavelength: 645nm; Forward Voltage: 1.9V; Case Code (Imperial): 1206; Mount: Surface Mount; Height: 680µm; RoHS: Compliant; REACH SVHC: Unknown; Case Code (Metric): 3216; Width: 1.6mm; Dominant Wavelength: 630nm; Packaging: Tape and Reel; Min Operating Temperature: -40°C; Max Operating Temperature: 85°C; Case/Package: 1206; Length: 3.2mm
DS251 = CMP-007-00022-2: LED Uni-Color Green, 100 mW, 30 mA, -55 to 85 degC, 2-Pin SMD, RoHS, Tape and Reel; Manufacturer: Lite-On; Power: 100mW; Forward Voltage: 2.1V; Viewing Angle: 130degrees; Forward Current: 20mA; Luminous Intensity: 6mcd; Lens Style: Clear; Manufacturer URL: http://www.us.liteon.com/; RoHS Compliant: True; Colour: Green; Package Description: 2-Pin Surface Mount Device, Body 1.6 x 0.8 mm; Datasheet URL: http://datasheet.octopart.com/LTST-C190GKT-Lite-On-datasheet-158530.pdf; Datasheet Version: Dec-06; Mounting Technology: SM; Case/Package: 0603; Package Reference: C190GKT; Packaging: TapeandReel; Min Operating Temperature: -55°C; Nominal Vf: 2.1V; Package Quantity: 3000; Illumination Colour: Green; Max Operating Temperature: 85°C; Pins: 2
J251 = CMP-02766-000264-1: 2 Position 1 Row .100" (2.54 mm) pitch connector; Number of Terminals/Pins: 2; Number of Ports: 1; Gender: Male; Max Current Rating: 7.4A; Connector Type: Male Pin; Max Voltage Rating (AC): 675V; Pitch: 2.54mm; Min Operating Temperature: -55°C; Number of Contacts: 2; Contact Plating: Gold; REACH SVHC: No SVHC; Packaging: Rail/Tube; Termination: Solder; Length: 6.6mm; Radiation Hardening: No; Contact Material: Bronze; Package Quantity: 1; Contact Mating Length: 0.215inch; Number of Positions: 2; Max Operating Temperature: 125°C; Orientation: Right Angle; Number of Rows: 1; Housing Material: Polymer; Depth: 9.65mm; Fastening Type: Ramp; Mount: Through Hole; Lead Free: Lead Free; Color: Natural
P250 = CMP-1024-00218-1: 0.025" SQ Post Header, Surface Mount, Vertical, -55 to 125 degC, 2.54 mm Pitch, 8-Pin, Male, RoHS; Manufacturer: Samtec; Pitch: 2.54 mm; ComponentLink3URL: http://www.samtec.com/documents/webfiles/cpdf/TSM-1XX-XX-XXX-XX-X-XXX-X-MKT.pdf; ComponentLink1URL: http://www.samtec.com; PackageDescription: Double Row Gullwing ASM; ComponentLink3Description: Package Specification; PackageVersion: DJ, 4/1991; ComponentLink1Description: Manufacturer URL; Orientation: Vertical; Temperature Range: -55 to 125 degC; PartNumber: TSM-104-01-S-DV; ComponentLink2Description: Datasheet; RoHS: True; Mounting Technology: Surface Mount; ComponentLink2URL: http://www.samtec.com/documents/webfiles/pdf/TSM.PDF; PackageReference: TSM-104-01-X-DV; DatasheetVersion: F-214
R180 = CMP-2000-00867-1: Manufacturer: Panasonic; Part Number: ERJ-L03KF50MV
R181 R182 = CMP-009-00158-3: Chip Resistor, 4,7 kOhms, +/-1 %, 63 mW, -55 to 155 degC, 0402; Power: 63mW; Tolerance: 1%; Max Operating Temperature: 155°C; Pins: 2; Value: 4.7k; Min Operating Temperature: -55°C; Case/Package: 0402
R250 = CMP-009-00015-5: Chip Resistor, 10 KOhm, +/- 1%, 0.1 W, -55 to 155 degC, 0402 (1005 Metric); Voltage Rating: 50V; Power: 100mW; Case/Package: 0402; Value: 10k; RoHS Compliant: True; Min Operating Temperature: -55°C; Mounting Technology: SM; Tolerance: 1%; Max Operating Temperature: 155°C; Pins: 2
R251 R253 = CMP-009-00009-5: Chip Resistor, 1 KOhm, +/- 1%, 0.1 W, -55 to 155 degC, 0402 (1005 Metric); Power: 100mW; Voltage Rating: 50V; Min Operating Temperature: -55°C; Max Operating Temperature: 155°C; RoHS Compliant: True; Mounting Technology: SM; Pins: 2; Tolerance: 1%; Case/Package: 0402; Value: 1k
R252 = CMP-2002-00799-3: Chip Resistor, 240 KOhm, +/- 1%, 100 mW, -55 to 155 degC, 0402 (1005 Metric), RoHS, Tape and Reel; Manufacturer: Basic Passives; PartNumber: ERJ-2RKF2403X; Power Rating: 100 mW; Voltage Rating: 50 V; Case\/Package: 0402; DatasheetVersion: 04/2015; RoHSCompliant: true; Resistance: 240 KOhm; Mounting Technology: Surface Mount; Case Code (Imperial): 0402; Height: 0.35 mm; Max Operating Temperature: 155 degC; PackageReference: 0402; ComponentLink1Description: Manufacturer URL; Min Operating Temperature: -55 degC; Package Quantity: 10000; Mount: Surface Mount; Radiation Hardening: No; Case Code (Metric): 1005; Packaging: Tape and Reel; Length: 1 mm; ComponentLink1URL: http://www.panasonic.com/; REACH SVHC: Unknown; Tolerance: 1%; Width: 0.5 mm; PackageDescription: 2-Pin Surface Mount Device, Body 1 x 0.5 mm; Pins: 2; ComponentLink2URL: http://industrial.panasonic.com/cdbs/www-data/pdf/RDA0000/AOA0000C86.pdf; ComponentLink2Description: Datasheet
U180 = CMP-09132-000025-1: IC BATT MONITOR MULTI-CHEM 8DFN; Interface: I2C; Case/Package: DFN; Packaging: Tape and Reel; Number of Pins: 8; Max Operating Temperature: 85°C; RoHS Compliant: Yes; Min Operating Temperature: -40°C
U250 = CMP-0395-01233-2: Single Output Automotive LDO, 1 A, Fixed 5 V Output, 2.7 to 10 V Input, 20-pin HTSSOP (PWP), -40 to 125 degC, Green (RoHS & no Sb/Br); Manufacturer: Texas Instruments; SubFamily: Single Channel LDO; Iout(Max)(A): 1; Vdo(Typ)(mV): 230; Fixed Output Options(V): 5; Vin(Max)(V): 10; Vin(Min)(V): 2.7; Accuracy(%): 2; Iq(Typ)(mA): 0.08; Eco-Plan: Green (RoHS & no Sb/Br); Code_JEDEC: MO-153; PackageVersion: 4073225-4/I; PartNumber: TPS76750QPWPRQ1; DatasheetVersion: SGLS009B; Mounting Technology: Surface Mount; Vout Adj(Max)(V): 5; ComponentLink3URL: http://www.ti.com/litv/pdf/mhts001g; Vout Adj(Min)(V): 5; ComponentLink3Description: Package Specification; ComponentLink1URL: http://www.ti.com/; ComponentLink1Description: Manufacturer URL; PackageReference: PWP0020L; ComponentLink2URL: http://www.ti.com/general/docs/lit/getliterature.tsp?genericPartNumber=TPS76750-Q1&fileType=pdf; ComponentLink2Description: Datasheet; PackageDescription: 20-Pin Plastic Small Outline, Body 4.4 x 6.5 mm, Pitch 0.65 mm
U251 = CMP-0337-00189-2: 1.65 A, 2.7 to 5.5 V Single Power Distribution Switch IC Hi-Side MOSFET, Fault Report, 33 mOhms rDS(On), -40 to 85 degC, 8-pin SOIC (D), Green (RoHS & no Sb/Br); Manufacturer: Texas Instruments; Continuous Current(Max)(A): 1.5; Enable: Active Low; Number of Switches: 1; Current Limit(A): 2.2; Vin(Max)(V): 5.5; Vin(Min)(V): 2.7; rDS(on) per FET(Typ)(mOhms): 33; Rating: Catalog; Eco-Plan: Green (RoHS & no Sb/Br); PartNumber: TPS2023D; PackageVersion: revM, Jun-2011; ComponentLink1URL: http://www.ti.com/general/docs/lit/getliterature.tsp?genericPartNumber=TPS2023&fileType=pdf; Code_JEDEC: MS-012AA; DatasheetVersion: SLVS175C; ComponentLink1Description: Datasheet; Mounting Technology: Surface Mount; PackageDescription: 8-Pin Plastic Small Outline Integrated Circuit, 4.9 x 3.9 mm, Pitch 1.27 mm Pitch; PackageReference: D0008A
U252 = CMP-04917-000317-1: IC REG LINEAR 3.3V 300MA 6WSON

## Sheet AllPins_Peripherals.SchDoc
size A4; SheetNumber: 8; SheetTotal: 10
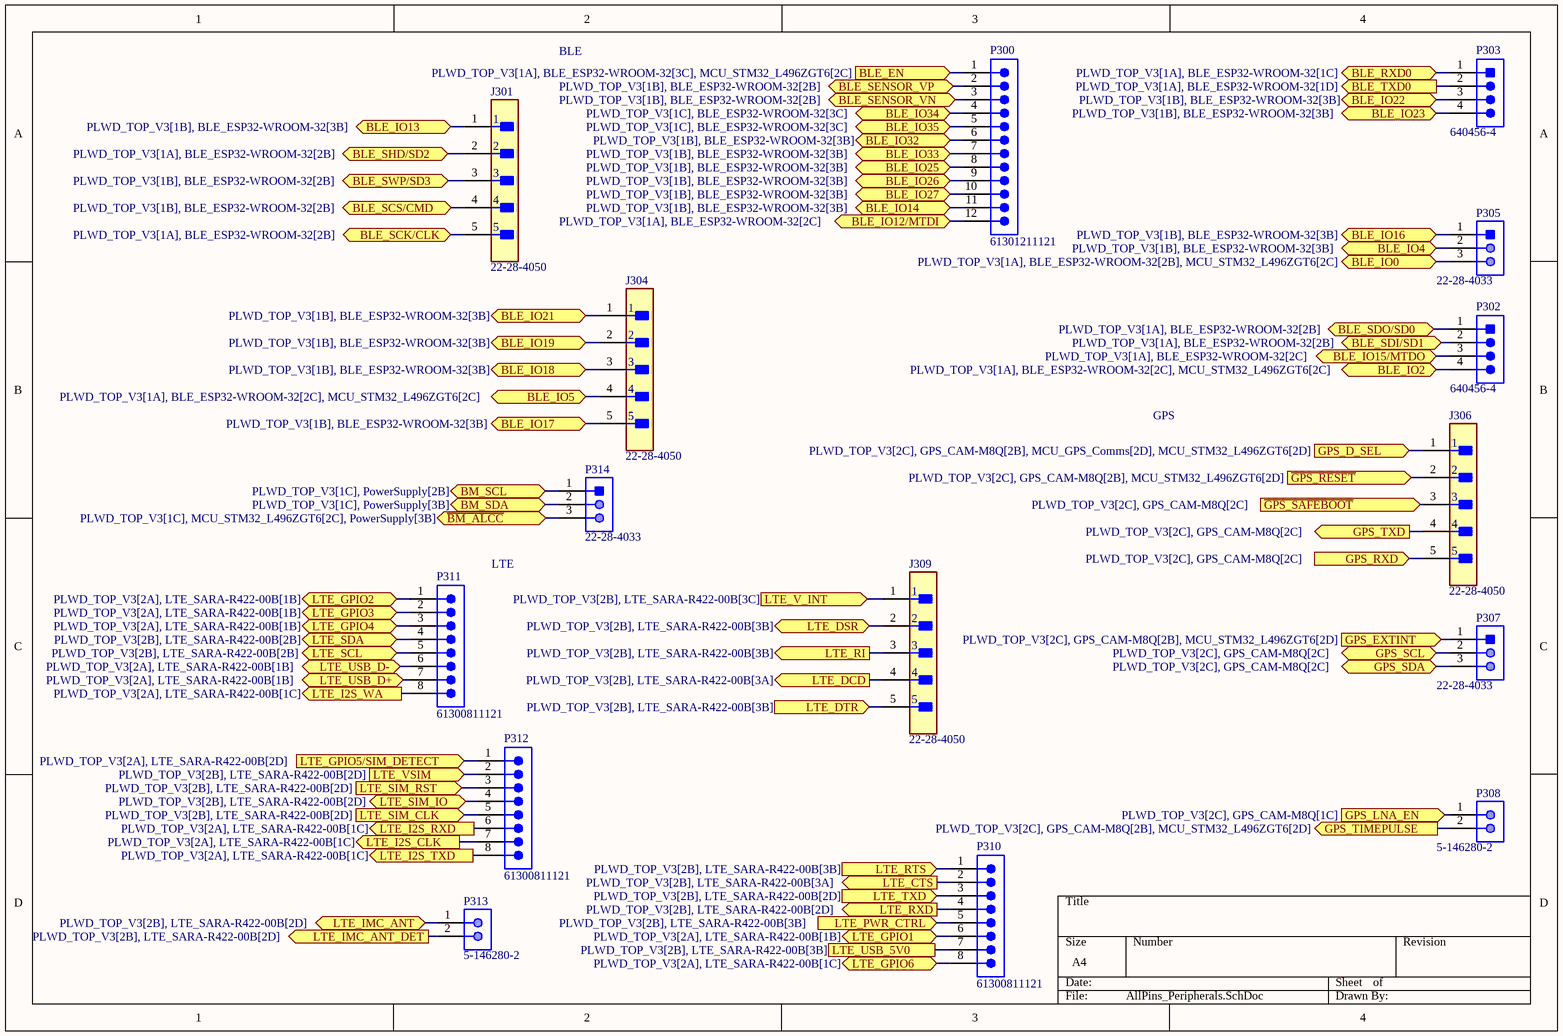
[diagram p6: AllPins_Peripherals.SchDoc]

### Parts
J301  22-28-4050  [FP-22-28-4050-MFG]
J304  22-28-4050  [FP-22-28-4050-MFG]
J306  22-28-4050  [FP-22-28-4050-MFG]
J309  22-28-4050  [FP-22-28-4050-MFG]
P300  61301211121  [61301211121]
P302  640456-4  [TECO-640456-4]
P303  640456-4  [TECO-640456-4]
P305  22-28-4033  [MOLX-22-28-4033_V]
P307  22-28-4033  [MOLX-22-28-4033_V]
P308  5-146280-2  [TECO-5-146280-2_V]
P310  61300811121  [61300811121]
P311  61300811121  [61300811121]
P312  61300811121  [61300811121]
P313  5-146280-2  [TECO-5-146280-2_V]
P314  22-28-4033  [MOLX-22-28-4033_V]

### Ports
BLE_EN (in, see PLWD_TOP_V3[1A], BLE_ESP32-WROOM-32[3C], MCU_STM32_L496ZGT6[2C]), BLE_IO0 (bidir, see PLWD_TOP_V3[1A], BLE_ESP32-WROOM-32[2B], MCU_STM32_L496ZGT6[2C]), BLE_IO2 (bidir, see PLWD_TOP_V3[1A], BLE_ESP32-WROOM-32[2C], MCU_STM32_L496ZGT6[2C]), BLE_IO4 (bidir, see PLWD_TOP_V3[1B], BLE_ESP32-WROOM-32[3B]), BLE_IO5 (bidir, see PLWD_TOP_V3[1A], BLE_ESP32-WROOM-32[2C], MCU_STM32_L496ZGT6[2C]), BLE_IO12/MTDI (bidir, see PLWD_TOP_V3[1A], BLE_ESP32-WROOM-32[2C]), BLE_IO13 (bidir, see PLWD_TOP_V3[1B], BLE_ESP32-WROOM-32[3B]), BLE_IO14 (bidir, see PLWD_TOP_V3[1B], BLE_ESP32-WROOM-32[3B]), BLE_IO15/MTDO (bidir, see PLWD_TOP_V3[1A], BLE_ESP32-WROOM-32[2C]), BLE_IO16 (bidir, see PLWD_TOP_V3[1B], BLE_ESP32-WROOM-32[3B]), BLE_IO17 (bidir, see PLWD_TOP_V3[1B], BLE_ESP32-WROOM-32[3B]), BLE_IO18 (bidir, see PLWD_TOP_V3[1B], BLE_ESP32-WROOM-32[3B]), BLE_IO19 (bidir, see PLWD_TOP_V3[1B], BLE_ESP32-WROOM-32[3B]), BLE_IO21 (bidir, see PLWD_TOP_V3[1B], BLE_ESP32-WROOM-32[3B]), BLE_IO22 (bidir, see PLWD_TOP_V3[1B], BLE_ESP32-WROOM-32[3B]), BLE_IO23 (bidir, see PLWD_TOP_V3[1B], BLE_ESP32-WROOM-32[3B]), BLE_IO25 (bidir, see PLWD_TOP_V3[1B], BLE_ESP32-WROOM-32[3B]), BLE_IO26 (bidir, see PLWD_TOP_V3[1B], BLE_ESP32-WROOM-32[3B]), BLE_IO27 (bidir, see PLWD_TOP_V3[1B], BLE_ESP32-WROOM-32[3B]), BLE_IO32 (bidir, see PLWD_TOP_V3[1B], BLE_ESP32-WROOM-32[3B]), BLE_IO33 (bidir, see PLWD_TOP_V3[1B], BLE_ESP32-WROOM-32[3B]), BLE_IO34 (bidir, see PLWD_TOP_V3[1C], BLE_ESP32-WROOM-32[3C]), BLE_IO35 (bidir, see PLWD_TOP_V3[1C], BLE_ESP32-WROOM-32[3C]), BLE_RXD0 (bidir, see PLWD_TOP_V3[1A], BLE_ESP32-WROOM-32[1C]), BLE_SCK/CLK (bidir, see PLWD_TOP_V3[1A], BLE_ESP32-WROOM-32[2B]), BLE_SCS/CMD (bidir, see PLWD_TOP_V3[1B], BLE_ESP32-WROOM-32[2B]), BLE_SDI/SD1 (bidir, see PLWD_TOP_V3[1A], BLE_ESP32-WROOM-32[2B]), BLE_SDO/SD0 (bidir, see PLWD_TOP_V3[1A], BLE_ESP32-WROOM-32[2B]), BLE_SENSOR_VN (bidir, see PLWD_TOP_V3[1B], BLE_ESP32-WROOM-32[2B]), BLE_SENSOR_VP (bidir, see PLWD_TOP_V3[1B], BLE_ESP32-WROOM-32[2B]), BLE_SHD/SD2 (bidir, see PLWD_TOP_V3[1A], BLE_ESP32-WROOM-32[2B]), BLE_SWP/SD3 (bidir, see PLWD_TOP_V3[1B], BLE_ESP32-WROOM-32[2B]), BLE_TXD0 (out, see PLWD_TOP_V3[1A], BLE_ESP32-WROOM-32[1D]), BM_SCL (bidir, see PLWD_TOP_V3[1C], PowerSupply[2B]), BM_SDA (bidir, see PLWD_TOP_V3[1C], PowerSupply[3B]), GPS_D_SEL (in, see PLWD_TOP_V3[2C], GPS_CAM-M8Q[2B], MCU_GPS_Comms[2D], MCU_STM32_L496ZGT6[2D]), GPS_EXTINT (in, see PLWD_TOP_V3[2C], GPS_CAM-M8Q[2B], MCU_STM32_L496ZGT6[2D]), GPS_LNA_EN (in, see PLWD_TOP_V3[2C], GPS_CAM-M8Q[1C]), GPS_RXD (in, see PLWD_TOP_V3[2C], GPS_CAM-M8Q[2C]), GPS_SCL (bidir, see PLWD_TOP_V3[2C], GPS_CAM-M8Q[2C]), GPS_SDA (bidir, see PLWD_TOP_V3[2C], GPS_CAM-M8Q[2C]), GPS_TIMEPULSE (out, see PLWD_TOP_V3[2C], GPS_CAM-M8Q[2B], MCU_STM32_L496ZGT6[2D]), GPS_TXD (out, see PLWD_TOP_V3[2C], GPS_CAM-M8Q[2C]), LTE_CTS (out, see PLWD_TOP_V3[2B], LTE_SARA-R422-00B[3A]), LTE_DCD (out, see PLWD_TOP_V3[2B], LTE_SARA-R422-00B[3A]), LTE_DSR (bidir, see PLWD_TOP_V3[2B], LTE_SARA-R422-00B[3B]), LTE_DTR (in, see PLWD_TOP_V3[2B], LTE_SARA-R422-00B[3B]), LTE_GPIO1 (bidir, see PLWD_TOP_V3[2A], LTE_SARA-R422-00B[1B]), LTE_GPIO2 (bidir, see PLWD_TOP_V3[2A], LTE_SARA-R422-00B[1B]), LTE_GPIO3 (bidir, see PLWD_TOP_V3[2A], LTE_SARA-R422-00B[1B]), LTE_GPIO4 (bidir, see PLWD_TOP_V3[2A], LTE_SARA-R422-00B[1B]), LTE_GPIO5/SIM_DETECT (in, see PLWD_TOP_V3[2A], LTE_SARA-R422-00B[2D]), LTE_GPIO6 (bidir, see PLWD_TOP_V3[2A], LTE_SARA-R422-00B[1C]), LTE_I2S_CLK (out, see PLWD_TOP_V3[2A], LTE_SARA-R422-00B[1C]), LTE_I2S_RXD (out, see PLWD_TOP_V3[2A], LTE_SARA-R422-00B[1C]), LTE_I2S_TXD (out, see PLWD_TOP_V3[2A], LTE_SARA-R422-00B[1C]), LTE_I2S_WA (out, see PLWD_TOP_V3[2A], LTE_SARA-R422-00B[1C]), LTE_IMC_ANT (bidir, see PLWD_TOP_V3[2B], LTE_SARA-R422-00B[2D]), LTE_IMC_ANT_DET (out, see PLWD_TOP_V3[2B], LTE_SARA-R422-00B[2D]), LTE_PWR_CTRL (in, see PLWD_TOP_V3[2B], LTE_SARA-R422-00B[3B]), LTE_RI (out, see PLWD_TOP_V3[2B], LTE_SARA-R422-00B[3B]), LTE_RTS (in, see PLWD_TOP_V3[2B], LTE_SARA-R422-00B[3B]), LTE_RXD (out, see PLWD_TOP_V3[2B], LTE_SARA-R422-00B[2D]), LTE_SCL (bidir, see PLWD_TOP_V3[2B], LTE_SARA-R422-00B[2B]), LTE_SDA (bidir, see PLWD_TOP_V3[2B], LTE_SARA-R422-00B[2B]), LTE_SIM_CLK (in, see PLWD_TOP_V3[2B], LTE_SARA-R422-00B[2D]), LTE_SIM_IO (bidir, see PLWD_TOP_V3[2B], LTE_SARA-R422-00B[2D]), LTE_SIM_RST (in, see PLWD_TOP_V3[2B], LTE_SARA-R422-00B[2D]), LTE_TXD (in, see PLWD_TOP_V3[2B], LTE_SARA-R422-00B[2D]), LTE_USB_5V0 (see PLWD_TOP_V3[2B], LTE_SARA-R422-00B[3B]), LTE_USB_D+ (bidir, see PLWD_TOP_V3[2A], LTE_SARA-R422-00B[1B]), LTE_USB_D- (bidir, see PLWD_TOP_V3[2A], LTE_SARA-R422-00B[1B]), LTE_V_INT (in, see PLWD_TOP_V3[2B], LTE_SARA-R422-00B[3C]), LTE_VSIM (in, see PLWD_TOP_V3[2B], LTE_SARA-R422-00B[2D]), ~{BM_ALCC} (bidir, see PLWD_TOP_V3[1C], MCU_STM32_L496ZGT6[2C], PowerSupply[3B]), ~{GPS_RESET} (in, see PLWD_TOP_V3[2C], GPS_CAM-M8Q[2B], MCU_STM32_L496ZGT6[2D]), ~{GPS_SAFEBOOT} (in, see PLWD_TOP_V3[2C], GPS_CAM-M8Q[2C])

### Nets
1V8: J309.1 ; port LTE_V_INT
~{BM_ALCC}: P314.3 ; port ~{BM_ALCC}
BLE_EN: P300.1 ; port BLE_EN
BLE_IO0: P305.3 ; port BLE_IO0
BLE_IO2: P302.4 ; port BLE_IO2
BLE_IO4: P305.2 ; port BLE_IO4
BLE_IO5: J304.4 ; port BLE_IO5
BLE_IO12/MTDI: P300.12 ; port BLE_IO12/MTDI
BLE_IO13: J301.1 ; port BLE_IO13
BLE_IO14: P300.11 ; port BLE_IO14
BLE_IO15_MTDO: P302.3 ; port BLE_IO15/MTDO
BLE_IO16: P305.1 ; port BLE_IO16
BLE_IO17: J304.5 ; port BLE_IO17
BLE_IO18: J304.3 ; port BLE_IO18
BLE_IO19: J304.2 ; port BLE_IO19
BLE_IO21: J304.1 ; port BLE_IO21
BLE_IO22: P303.3 ; port BLE_IO22
BLE_IO23: P303.4 ; port BLE_IO23
BLE_IO25: P300.8 ; port BLE_IO25
BLE_IO26: P300.9 ; port BLE_IO26
BLE_IO27: P300.10 ; port BLE_IO27
BLE_IO32: P300.6 ; port BLE_IO32
BLE_IO33: P300.7 ; port BLE_IO33
BLE_IO34: P300.4 ; port BLE_IO34
BLE_IO35: P300.5 ; port BLE_IO35
BLE_RXD0: P303.1 ; port BLE_RXD0
BLE_SCK/CLK: J301.5 ; port BLE_SCK/CLK
BLE_SCS/CMD: J301.4 ; port BLE_SCS/CMD
BLE_SDI/SD1: P302.2 ; port BLE_SDI/SD1
BLE_SDO/SD0: P302.1 ; port BLE_SDO/SD0
BLE_SENSOR_VN: P300.3 ; port BLE_SENSOR_VN
BLE_SENSOR_VP: P300.2 ; port BLE_SENSOR_VP
BLE_SHD/SD2: J301.2 ; port BLE_SHD/SD2
BLE_SWP/SD3: J301.3 ; port BLE_SWP/SD3
BLE_TXD0: P303.2 ; port BLE_TXD0
BM_SCL: P314.1 ; port BM_SCL
BM_SDA: P314.2 ; port BM_SDA
~{GPS_RESET}: J306.2 ; port ~{GPS_RESET}
~{GPS_SBT}: J306.3 ; port ~{GPS_SAFEBOOT}
GPS_D_SEL: J306.1 ; port GPS_D_SEL
GPS_EXTINT: P307.1 ; port GPS_EXTINT
GPS_LNA_EN: P308.1 ; port GPS_LNA_EN
GPS_RXD/SPI_MOSI: J306.5 ; port GPS_RXD
GPS_SCL/SPI_CLK: P307.2 ; port GPS_SCL
GPS_SDA/SPI_SSEL: P307.3 ; port GPS_SDA
GPS_TIMEPULSE: P308.2 ; port GPS_TIMEPULSE
GPS_TXD/SPI_MISO: J306.4 ; port GPS_TXD
IMC_ANT: P313.1 ; port LTE_IMC_ANT
IMP_ANT_DET: P313.2 ; port LTE_IMC_ANT_DET
LTE_CTS: P310.2 ; port LTE_CTS
LTE_DCD: J309.4 ; port LTE_DCD
LTE_DSR: J309.2 ; port LTE_DSR
LTE_DTR: J309.5 ; port LTE_DTR
LTE_GPIO1: P310.6 ; port LTE_GPIO1
LTE_GPIO2: P311.1 ; port LTE_GPIO2
LTE_GPIO3: P311.2 ; port LTE_GPIO3
LTE_GPIO4: P311.3 ; port LTE_GPIO4
LTE_GPIO5/SIM_DETECT: P312.1 ; port LTE_GPIO5/SIM_DETECT
LTE_GPIO6: P310.8 ; port LTE_GPIO6
LTE_I2S_CLK: P312.7 ; port LTE_I2S_CLK
LTE_I2S_RXD: P312.6 ; port LTE_I2S_RXD
LTE_I2S_TXD: P312.8 ; port LTE_I2S_TXD
LTE_I2S_WA: P311.8 ; port LTE_I2S_WA
LTE_PWR_CTRL: P310.5 ; port LTE_PWR_CTRL
LTE_RI: J309.3 ; port LTE_RI
LTE_RTS: P310.1 ; port LTE_RTS
LTE_RXD: P310.4 ; port LTE_RXD
LTE_SCL: P311.5 ; port LTE_SCL
LTE_SDA: P311.4 ; port LTE_SDA
LTE_SIM_CLK: P312.5 ; port LTE_SIM_CLK
LTE_SIM_IO: P312.4 ; port LTE_SIM_IO
LTE_SIM_RST: P312.3 ; port LTE_SIM_RST
LTE_TXD: P310.3 ; port LTE_TXD
LTE_USB_5V0: P310.7 ; port LTE_USB_5V0
LTE_USB_D+: P311.7 ; port LTE_USB_D+
LTE_USB_D-: P311.6 ; port LTE_USB_D-
LTE_VSIM: P312.2 ; port LTE_VSIM

### Notes on the sheet
- BLE
- GPS
- LTE

### Library data of the parts
J301 J304 J306 J309 = CMP-00257-00278173-1: 22-28-4050 KK® 254 Breakaway Header, Vertical, 5 Circuits, Tin (Sn) Plating, Mating Pin Length 6.09mm; NexarPartId: 278173; Voltage Rating: 250V; Number of Contacts: 5; Contact Resistance: 20mΩ; Gender: Male; Pitch: 2.54mm; Connector Type: Male Pin; Current Rating: 4A; Glow Wire Compliant: Non-compliant; Max Voltage Rating (DC): 250.25kV; Flammability Rating: UL94 V-0; Min Operating Temperature: 0°C; REACH SVHC: Unknown; Lead Free: Lead Free; Termination: Solder; RoHS: Compliant; Schedule B: 8536694040; Number of Circuits: 5; Mount: Through Hole; Lead Pitch: 2.54mm; Height: 2.29mm; Voltage Rating (DC): 250V; Max Operating Temperature: 75°C; Width: 2.49mm; Radiation Hardening: No; Contact Plating: Tin; Orientation: Vertical; Length: 12.7mm; Number of Rows: 1; Housing Material: Thermoplastic; Contact Material: Brass; Packaging: Bulk; Contact Mating Length: 6.096mm; Housing Color: Black; Color: Black; Number of Positions: 5
P300 = CMP-1502-01086-2: NexarPartId: 32855538; Gender: Male; Pitch: 2.54mm; Contact Resistance: 20mΩ; Number of Positions: 12; Current Rating: 3A; Connector Type: Male Pin; Operating Supply Voltage: 250V; Contact Material: Copper; Contact Plating: Gold; Color: Black; REACH SVHC: Unknown; Termination: Solder; Number of Contacts: 12; RoHS: Compliant; Lead Pitch: 2.54mm; Orientation: Vertical; Contact Mating Length: 5.9944mm; Mount: Through Hole; Number of Pins: 12; Packaging: Bulk; Number of Rows: 1
P302 P303 = CMP-2000-05419-1: Male Header, Pitch 2.54 mm, 1 x 4 Position, Height 10.03 mm, Tail Length 3.56 mm, RoHS, Bulk; Manufacturer: TE Connectivity; Material, Housing: Polyester; Primary Type: InterconnectSystem; Mount Angle: Vertical; Color, Housing: White; Current, Rating: 5 / A; Agency Approvals: CSA,UL; Contact Termination Area Plating: Tin; Temperature, Operating: -55to+105 / degC; Standards: RoHSCompliant,ELVCompliant,UL94V-0; Number of Positions: 4; Brand/Series: MTA-100Series; Angle: Straight; Pin Spacing: 0.1 / "; Material, Contact: CopperAlloy; Connector Type: MTA-100; Special Features: Pinstrip; Mounting Hole Size: 0.04 / "; Contact Centerline Spacing: 0.100 / in.; Voltage, Rating: 250 / V; Manufacturer URL: http://www.te.com/; Length, Pin: 0.14 / "; Length, Overall: 0.4 / "; Color: White; Flammability Rating: UL94V-0; Mounting Type: PCMount; Termination: Solder; Datasheet URL: https://datasheet.ciiva.com/16286/eng-ds-82056-mta-0608-16286228.pdf; Number of Contacts: 4; Contact Shape: Square; Contact Mating Area Plating: Tin; Length, Terminal Post: 0.14 / in.; Size, Post: 0.025 / in.; Contact Plating: Tin; Type: PCBPlug; Datasheet Version: Dec-14; Number of Rows: 1
P305 P307 P314 = CMP-1676-00001-5: Male Header, Pitch 2.54 mm, 1 x 3 Position, Height 8.38 mm, Tail Length 3.18 mm, RoHS, Bulk; Manufacturer: Molex; Rows: 1; Voltage Rating: 250 V; Current Rating: 4 A; Min Operating Temperature: 0 degC; Lead Pitch: 0.1 inch; Packaging: Bulk; Contact Finish: Gold; RoHSCompliant: true; Contact Material: Brass; PackageReference: 22-28-4033; REACH SVHC: Unknown; PackageDescription: Male Header, Pitch 2.54 mm, 1 x 3 Position, Height 8.38 mm, Tail Length 3.18 mm; ComponentLink2URL: http://www.molex.com/pdm_docs/sd/022284033_sd.pdf; Height: 8.38 mm; Mounting Technology: Through Hole; ComponentLink1Description: Manufacturer URL; Length: 7.62 mm; Mount: Through Hole; DatasheetVersion: Rev. G, 01/2012; Max Operating Temperature: 75 degC; ComponentLink2Description: Datasheet; Colour: Black; Pins: 3; Contact Plating: Gold; Package Quantity: 1; ComponentLink1URL: http://www.molex.com/
P308 P313 = CMP-2000-07492-1: Male Header, Pitch 2.54 mm, 1 x 2 Position, Height 8.21 mm, Tail Length 3.05 mm, -65 to 105 degC, RoHS, Bulk; Manufacturer: TE Connectivity; Mating Connector Lock: No(Without); Number of Positions: 2; Pitch: 2.54mm; PCB Mounting Orientation: Vertical; Keyed: No; Case\/Package: 100; Mating Post Length: 0.23inch; High Temperature Housing: Yes; Max Current Rating: 5A; PCB Thickness: 0.063inch; PCB Mount Retention: Without; Approvals: CSA; Current Rating: 3A; Radiation Hardening: No; Length: 4.67mm; Contact Mating Length: 0.23inch; Connector Type: Header; Number of Rows: 1; Termination Post Length: 0.12inch; Board Standoff: No(Without); Max Operating Temperature: 105degC; Contact Shape: Square; Selectively Loaded: No(Without); Gasket: No(Without); Number of Contacts: 2; Contact Gender: Male; Mating Alignment: No(Without); Manufacturer URL: http://www.te.com/; Datasheet URL: http://www.te.com/commerce/DocumentDelivery/DDEController?Action=showdoc&DocId=Customer+Drawing%7F146280%7FH1%7Fpdf%7FEnglish%7FENG_CD_146280_H1.pdf%7F5-146280-2; Mount: ThroughHole; Orientation: Straight; Packaging: Carton; Package Reference: 5-146280-2; Package Quantity: 500; Stabilizers: No(Without); Row Spacing: 2.54mm; Contact Material: CopperAlloy; Panel Mount Retention: No(Without); Datasheet Version: Rev. H1, 08/2016; Housing Colour: Black; Colour: Black; Package Description: Male Header, Pitch 2.54 mm, 1 x 2 Position, Height 8.21 mm, Tail Length 3.05 mm; Contact Plating: Matte; Housing Material: Polymer; Contact Protection: No(Without); Min Operating Temperature: -65degC; Mounting Technology: ThroughHole; Flammability Rating: UL94V-0; RoHSCompliant: true; Termination: ThroughHole; Depth: 2.34mm; High Speed Serial Data Connector: No
P310-P312 = CMP-1502-01076-2: NexarPartId: 32855533; Current Rating: 3A; Connector Type: Male Pin; Voltage Rating: 250V; Number of Contacts: 8; Pitch: 2.54mm; Contact Resistance: 20mΩ; Gender: Male; REACH SVHC: Unknown; Number of Rows: 1; Mount: Through Hole; Termination: Solder; Number of Pins: 8; Number of Positions: 8; Height: 8.54mm; Contact Mating Length: 5.9944mm; Orientation: Vertical; Operating Supply Voltage: 250V; Min Operating Temperature: -40°C; Max Operating Temperature: 105°C; Packaging: Bulk; Color: Black; Lead Pitch: 2.54mm; RoHS: Compliant; Contact Material: Copper; Contact Plating: Gold

## Sheet AllPins_MCU.SchDoc
size A4; SheetNumber: 7; SheetTotal: 10
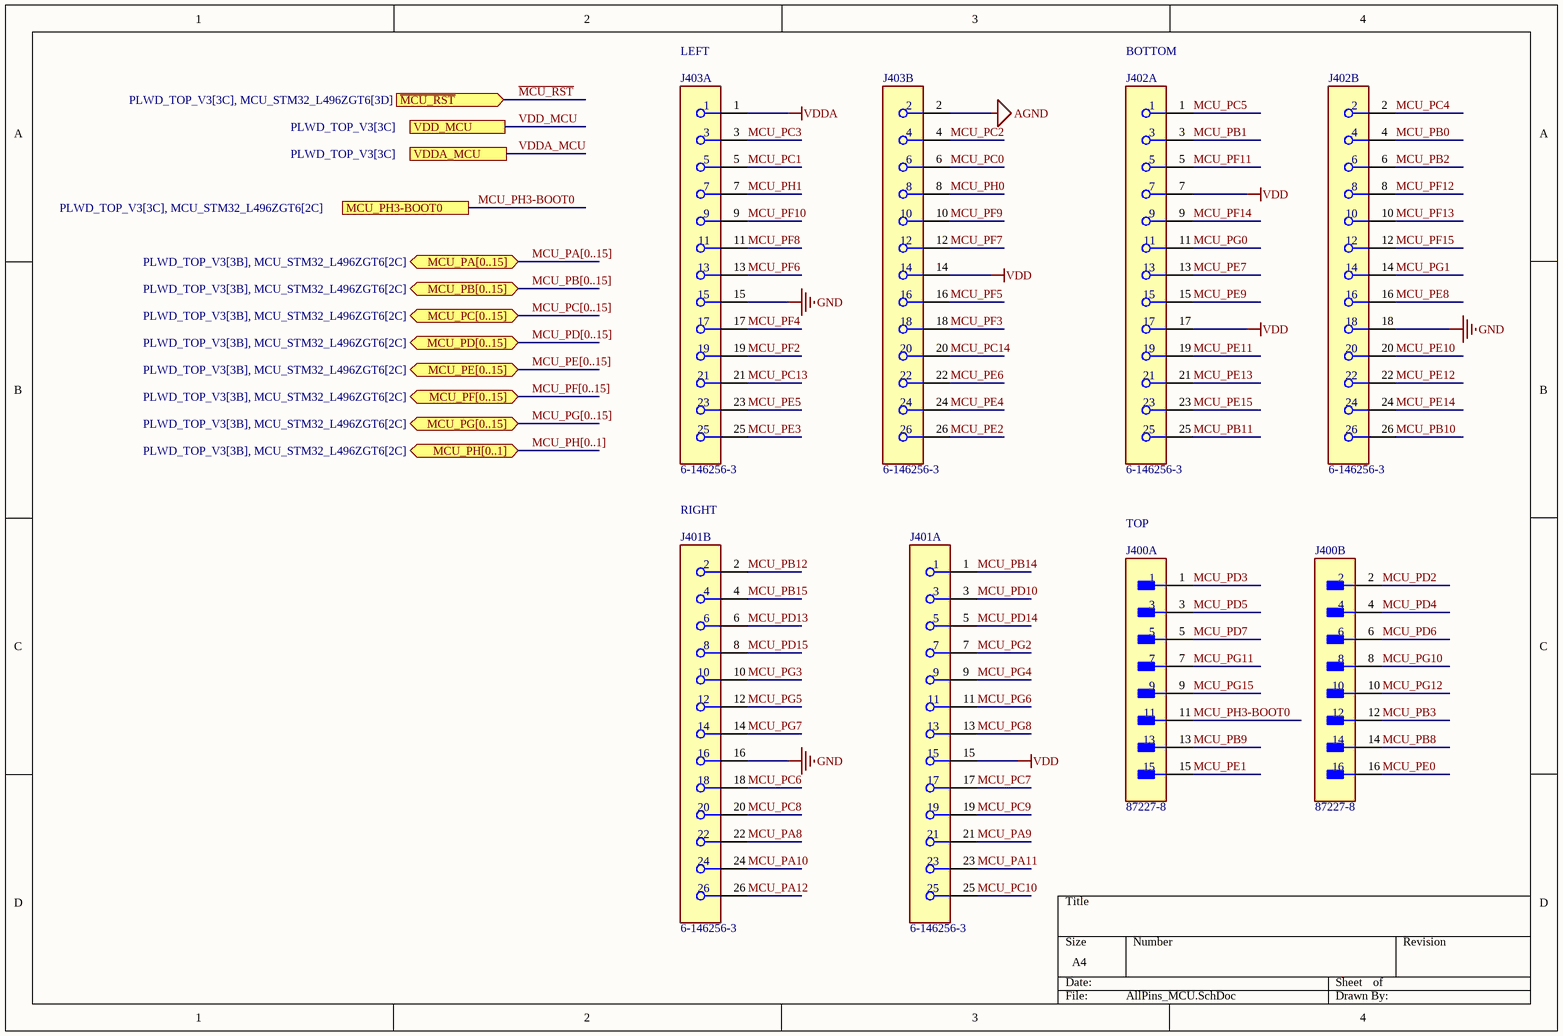
[diagram p7: AllPins_MCU.SchDoc]

### Parts
J400  87227-8  [FP-87227-8-MFG]  (parts A,B of 2)
J401  6-146256-3  [FP-6-146256-3-MFG]  (parts A,B of 2)
J402  6-146256-3  [FP-6-146256-3-MFG]  (parts A,B of 2)
J403  6-146256-3  [FP-6-146256-3-MFG]  (parts A,B of 2)

### Ports
MCU_PA[0..15] (bidir, see PLWD_TOP_V3[3B], MCU_STM32_L496ZGT6[2C]), MCU_PB[0..15] (bidir, see PLWD_TOP_V3[3B], MCU_STM32_L496ZGT6[2C]), MCU_PC[0..15] (bidir, see PLWD_TOP_V3[3B], MCU_STM32_L496ZGT6[2C]), MCU_PD[0..15] (bidir, see PLWD_TOP_V3[3B], MCU_STM32_L496ZGT6[2C]), MCU_PE[0..15] (bidir, see PLWD_TOP_V3[3B], MCU_STM32_L496ZGT6[2C]), MCU_PF[0..15] (bidir, see PLWD_TOP_V3[3B], MCU_STM32_L496ZGT6[2C]), MCU_PG[0..15] (bidir, see PLWD_TOP_V3[3B], MCU_STM32_L496ZGT6[2C]), MCU_PH3-BOOT0 (see PLWD_TOP_V3[3C], MCU_STM32_L496ZGT6[2C]), MCU_PH[0..1] (bidir, see PLWD_TOP_V3[3B], MCU_STM32_L496ZGT6[2C]), VDD_MCU (see PLWD_TOP_V3[3C]), VDDA_MCU (see PLWD_TOP_V3[3C]), ~{MCU_RST} (in, see PLWD_TOP_V3[3C], MCU_STM32_L496ZGT6[3D])

### Nets
AGND: J403.2
GND: J401.16 J402.18 J403.15
VDD_MCU: J401.15 J402.7 J402.17 J403.14 ; port VDD_MCU  [also labelled VDD]
VDDA_MCU: J403.1 ; port VDDA_MCU  [also labelled VDDA]
MCU_PA8: J401.22
MCU_PA9: J401.21
MCU_PA10: J401.24
MCU_PA11: J401.23
MCU_PA12: J401.26
MCU_PB0: J402.4
MCU_PB1: J402.3
MCU_PB2: J402.6
MCU_PB3: J400.12
MCU_PB8: J400.14
MCU_PB9: J400.13
MCU_PB10: J402.26
MCU_PB11: J402.25
MCU_PB12: J401.2
MCU_PB14: J401.1
MCU_PB15: J401.4
MCU_PC0: J403.6
MCU_PC1: J403.5
MCU_PC2: J403.4
MCU_PC3: J403.3
MCU_PC4: J402.2
MCU_PC5: J402.1
MCU_PC6: J401.18
MCU_PC7: J401.17
MCU_PC8: J401.20
MCU_PC9: J401.19
MCU_PC10: J401.25
MCU_PC13: J403.21
MCU_PC14: J403.20
MCU_PD2: J400.2
MCU_PD3: J400.1
MCU_PD4: J400.4
MCU_PD5: J400.3
MCU_PD6: J400.6
MCU_PD7: J400.5
MCU_PD10: J401.3
MCU_PD13: J401.6
MCU_PD14: J401.5
MCU_PD15: J401.8
MCU_PE0: J400.16
MCU_PE1: J400.15
MCU_PE2: J403.26
MCU_PE3: J403.25
MCU_PE4: J403.24
MCU_PE5: J403.23
MCU_PE6: J403.22
MCU_PE7: J402.13
MCU_PE8: J402.16
MCU_PE9: J402.15
MCU_PE10: J402.20
MCU_PE11: J402.19
MCU_PE12: J402.22
MCU_PE13: J402.21
MCU_PE14: J402.24
MCU_PE15: J402.23
MCU_PF2: J403.19
MCU_PF3: J403.18
MCU_PF4: J403.17
MCU_PF5: J403.16
MCU_PF6: J403.13
MCU_PF7: J403.12
MCU_PF8: J403.11
MCU_PF9: J403.10
MCU_PF10: J403.9
MCU_PF11: J402.5
MCU_PF12: J402.8
MCU_PF13: J402.10
MCU_PF14: J402.9
MCU_PF15: J402.12
MCU_PG0: J402.11
MCU_PG1: J402.14
MCU_PG2: J401.7
MCU_PG3: J401.10
MCU_PG4: J401.9
MCU_PG5: J401.12
MCU_PG6: J401.11
MCU_PG7: J401.14
MCU_PG8: J401.13
MCU_PG10: J400.8
MCU_PG11: J400.7
MCU_PG12: J400.10
MCU_PG15: J400.9
MCU_PH0: J403.8
MCU_PH1: J403.7
MCU_PH3-BOOT0: J400.11 ; port MCU_PH3-BOOT0

### Buses and harness runs
bus MCU_PA[0..15] = port MCU_PA[0..15]
bus MCU_PB[0..15] = port MCU_PB[0..15]
bus MCU_PC[0..15] = port MCU_PC[0..15]
bus MCU_PD[0..15] = port MCU_PD[0..15]
bus MCU_PE[0..15] = port MCU_PE[0..15]
bus MCU_PF[0..15] = port MCU_PF[0..15]
bus MCU_PG[0..15] = port MCU_PG[0..15]
bus MCU_PH[0..1] = port MCU_PH[0..1]

### Notes on the sheet
- LEFT
- BOTTOM
- RIGHT
- TOP

### Library data of the parts
J400 = CMP-03369-000064-1: CONN HEADER VERT 16POS 2.54MM; Manufacturer: TE Connectivity; Conn Gender: Male; Conn Orientation: Straight; Current Rating: 3A; Number Of Contacts: 16; Mouser Description: Headers & Wire Housings UNSHRD VERT DUAL 16; Lead Free: Yes; Digikey Description: CONN HEADER VERT 16POS 2.54MM; Device Class L3: unset; Automotive: No; Height: 0.428inch; Temperature Range Low: -65°C; Device Class L1: Connectors; RoHS: TRUE; Pitch: 2.54mm; Package: 0; Manufacturer Part Number: 87227-8; Number Of Rows: 2; Footprint Url: https://www.te.com/commerce/DocumentDelivery/DDEController?Action=showdoc&DocId=Customer+Drawing%7F87227%7FH4%7Fpdf%7FEnglish%7FENG_CD_87227_H4.pdf%7F87227-8; ComponentLink2URL: https://www.te.com/usa-en/product-87227-8.datasheet.pdf; ComponentLink2Description: Datasheet; Temperature: -65°C to +105°C; Category: Conn; Temperature Range High: +105°C; Octopart: https://octopart.com/87227-8-te+connectivity-39407754; Device Class L2: Headers and Wire Housings; Contact Material: Gold,Nickel
J401-J403 = CMP-03369-000069-1: CONN HEADER VERT 26POS 2.54MM; Manufacturer: TE Connectivity; Current Rating: 3A; Is Female: yes; Conn Gender: Male; Number Of Contacts: 26; Voltage Rating: 30V; Conn Orientation: Vertical; Temperature Range Low: -65°C; Mouser Description: Headers & Wire Housings 26P HDR DRST B/A; Lead Free: Yes; Automotive: No; Device Class L3: unset; Height: 8.72mm; ComponentLink2Description: Datasheet; Digikey Description: CONN HEADER VERT 26POS 2.54MM; Device Class L2: Headers and Wire Housings; Pitch: 2.54mm; Octopart: https://octopart.com/6-146256-3-te+connectivity-40624960; Contact Material: Gold,Nickel; RoHS: TRUE; Temperature Range High: +105°C; Temperature: -65°C to +105°C; Number Of Rows: 2; Category: Conn; Manufacturer Part Number: 6-146256-3; Device Class L1: Connectors; ComponentLink2URL: https://www.te.com/commerce/DocumentDelivery/DDEController?Action=showdoc&DocId=Customer+Drawing%7F146256%7FH%7Fpdf%7FEnglish%7FENG_CD_146256_H.pdf%7F6-146256-3; Package: 6-146256-3